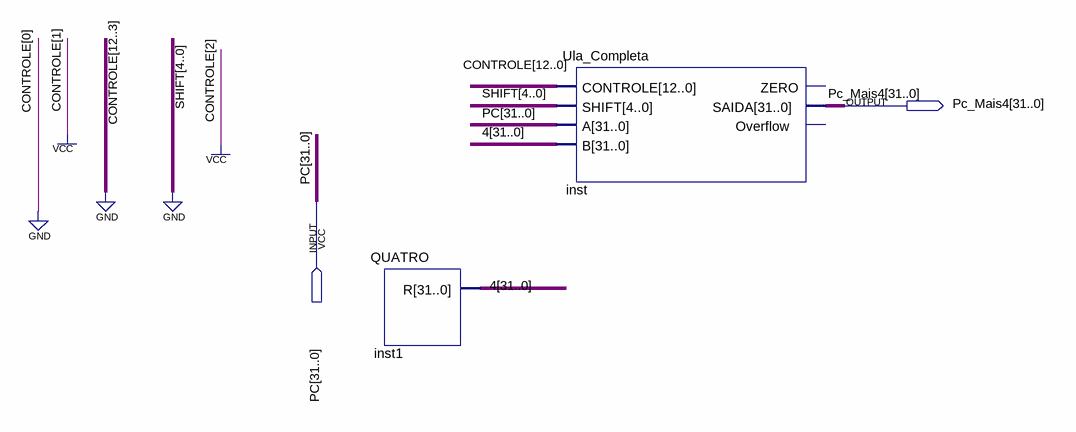
[diagram p0: schematic sheet]
// Quartus schematic sub_Pc.bdf as structural Verilog: 2 symbols, 2 pins
module sub_Pc (
  input  [31:0] PC,
  output [31:0] Pc_Mais4
);

  wire [31:0] \4 ;

  QUATRO inst1 (.R(\4 ));
  Ula_Completa inst (
    .CONTROLE(13'b0000000000110), .SHIFT({5{1'b0}}), .A(PC), .B(\4 ), .SAIDA(Pc_Mais4));  // open: ZERO, Overflow
endmodule
